# Altium project PCB_Project.PrjPcb
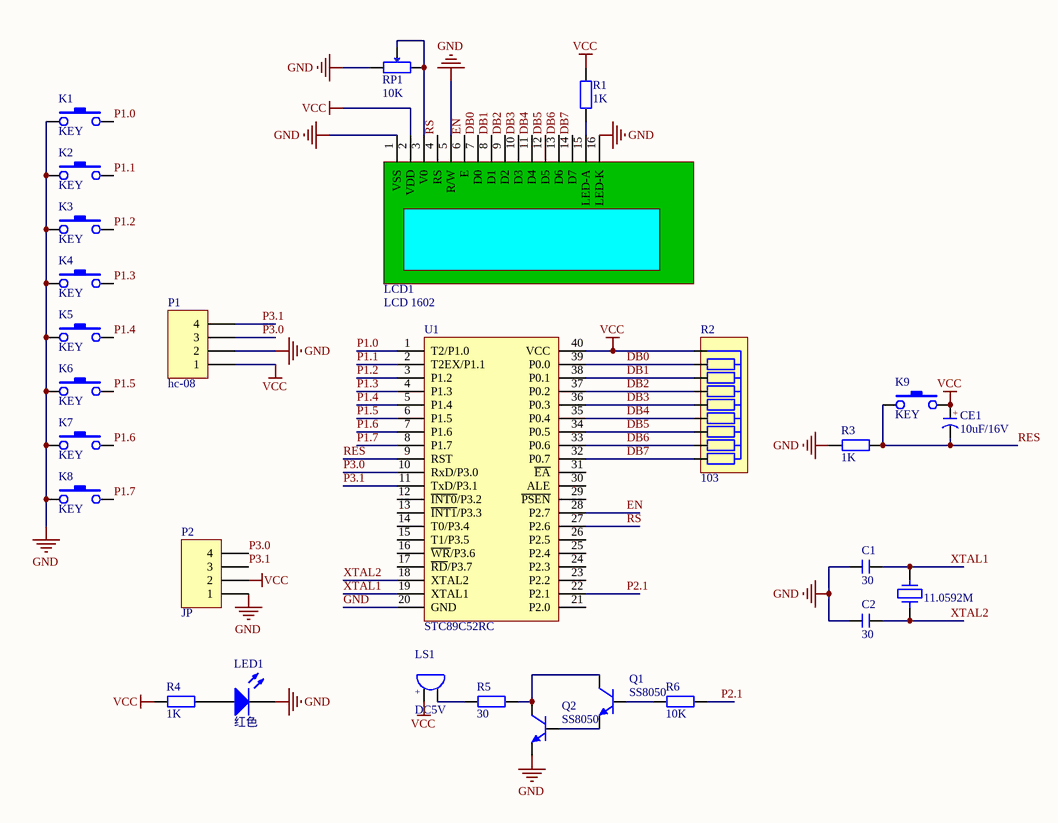
[diagram p0: 液晶屏电子琴.SchDoc]
1 sheet, 28 parts. Net scope: global (net labels, ports and power ports of the same name join across sheets).
Board files: 液晶屏电子琴222.PcbDoc, PCB1.PcbDoc

## Sheet 液晶屏电子琴.SchDoc
size A4

### Parts
?  11.0592M  [HC-49S]
C1  30  [CC 1.8*3.6]
C2  30  [CC 1.8*3.6]
CE1  10uF/16V  [CAP 1.5*4*8]
K1  KEY  [SW1]
K2  KEY  [SW1]
K3  KEY  [SW1]
K4  KEY  [SW1]
K5  KEY  [SW1]
K6  KEY  [SW1]
K7  KEY  [SW1]
K8  KEY  [SW1]
K9  KEY  [SW1]
LCD1  LCD 1602  [LCD-1602]
LED1  红色  [LED 5MM-B]
LS1  DC5V  [BEEP 5x9x5.5]
P1  hc-08  [HDR1X4]
P2  JP  [HDR1X4]
Q1  SS8050  [TO92A]
Q2  SS8050  [TO92A]
R1  1K  [RS 1/4W]
R2  103  [R SIP9-2.54]
R3  1K  [RS 1/4W]
R4  1K  [RS 1/4W]
R5  30  [RS 1/4W]
R6  10K  [RS 1/4W]
RP1  10K  [RM065]
U1  STC89C52RC  [DIP40-600]

### Nets
GND: C1.1 C2.1 K1.1 K2.1 K3.1 K4.1 K5.1 K6.1 K7.1 K8.1 LCD1.1(VSS) LCD1.5(R/W) LCD1.16(LED-K) LED1.2(K) P1.2 P2.1 Q2.1(E) R3.1 RP1.1 U1.20(GND)
VCC: CE1.1(A) K9.2 LCD1.2(VDD) LS1.1 P1.1 P2.2 R1.2 R2.1 R4.1 U1.40(VCC)
DB0: LCD1.7(D0) R2.2 U1.39(P0.0)
DB1: LCD1.8(D1) R2.3 U1.38(P0.1)
DB2: LCD1.9(D2) R2.4 U1.37(P0.2)
DB3: LCD1.10(D3) R2.5 U1.36(P0.3)
DB4: LCD1.11(D4) R2.6 U1.35(P0.4)
DB5: LCD1.12(D5) R2.7 U1.34(P0.5)
DB6: LCD1.13(D6) R2.8 U1.33(P0.6)
DB7: LCD1.14(D7) R2.9 U1.32(P0.7)
EN: LCD1.6(E) U1.28(P2.7)
P1.0: K1.2 U1.1(T2/P1.0)
P1.1: K2.2 U1.2(T2EX/P1.1)
P1.2: K3.2 U1.3(P1.2)
P1.3: K4.2 U1.4(P1.3)
P1.4: K5.2 U1.5(P1.4)
P1.5: K6.2 U1.6(P1.5)
P1.6: K7.2 U1.7(P1.6)
P1.7: K8.2 U1.8(P1.7)
P2.1: R6.2 U1.22(P2.1)
P3.0: P1.3 P2.4 U1.10(RxD/P3.0)
P3.1: P1.4 P2.3 U1.11(TxD/P3.1)
RES: CE1.2(K) K9.1 R3.2 U1.9(RST)
RS: LCD1.4(RS) U1.27(P2.6)
XTAL1: ?.2 C1.2 U1.19(XTAL1)
XTAL2: ?.1 C2.2 U1.18(XTAL2)
NetLCD1_3: LCD1.3(V0) RP1.2 RP1.3
NetLCD1_15: LCD1.15(LED-A) R1.1
NetLED1_1: LED1.1(A) R4.2
NetLS1_2: LS1.2 R5.1
NetQ1_1: Q1.1(E) Q2.2(B)
NetQ1_2: Q1.2(B) R6.1
NetQ1_3: Q1.3(C) Q2.3(C) R5.2

Not connected (* = marked no-connect by the designer): U1 12(~{INT0}/P3.2) 13(~{INT1}/P3.3) 14(T0/P3.4) 15(T1/P3.5) 16(~{WR}/P3.6) 17(~{RD}/P3.7) 21(P2.0) 23(P2.2) 24(P2.3) 25(P2.4) 26(P2.5) 29(~{PSEN}) 30(ALE) 31(~{EA})

### Notes on the sheet
- (in symbol BEEP) +
- (in symbol CE) +

### Library data of the parts
? = XT: 晶振
C1 C2 = CC: 瓷片电容; BOM名称: 直插瓷片电容; 淘宝ID: 封装库来自淘宝 ID：黄晶宝石; 封装库来自淘宝卖家 ID：黄晶宝石: 其他店铺购入均为盗版，不享受售后技术支持服务，请立即申请退款; 联系售后: https://shop463601444.taobao.com
CE1 = CE: 直插电解电容; 淘宝ID: 封装库来自淘宝 ID：黄晶宝石; BOM名称: 直插电解电容; 联系售后: https://shop463601444.taobao.com
LCD1 = LCD 1602: 版权归属: 封装库来自淘宝 ID：黄晶宝石; BOM名称: LCD 1602; 技术支持，联系售后: https://shop463601444.taobao.com
LED1 = LED-5MM: 直插5mm LED; BOM名称: 5mm插件LED; 版权归属: 封装库来自淘宝 ID：黄晶宝石; 学习资源: https://shop463601444.taobao.com
LS1 = BEEP: 蜂鸣器; 版权归属: 封装库来自淘宝 ID：黄晶宝石; BOM名称: 蜂鸣器; 技术支持，联系售后: https://shop463601444.taobao.com
P1 P2 = Header 4: Header, 4-Pin; LatestRevisionDate: 17-Jul-2002; LatestRevisionNote: Re-released for DXP Platform.; Publisher: Altium Limited
Q1 Q2 = 8050-DIP: 高频放大-NPN型; 版权归属: 封装库来自淘宝 ID：黄晶宝石; 属性: 40V 1.5A 1W 100MHZ; BOM名称: 高频放大-NPN型; 技术支持，联系售后: https://shop463601444.taobao.com
R1 R3-R6 = R-S: 色环电阻; 版权归属: 封装库来自淘宝 ID：黄晶宝石; BOM名称: 色环电阻; 联系售后: https://shop463601444.taobao.com
R2 = R SIP9: 9脚直插排阻; BOM名称: 单列直插排阻; 淘宝ID: 封装库来自淘宝 ID：黄晶宝石; 联系售后: https://shop463601444.taobao.com
RP1 = RP: 单联电位器; BOM名称: 插件电位器; 版权归属: 封装库来自淘宝 ID：黄晶宝石; 联系售后: https://shop463601444.taobao.com
U1 = STC89C52RC: STC单片机; 版权归属: 封装库来自淘宝 ID：黄晶宝石; BOM名称: STC单片机; 学习资源: https://shop463601444.taobao.com